# EAGLE design SRAM 4MB 2048kbx16 CPLD_2.1 (EAGLE 6.4)
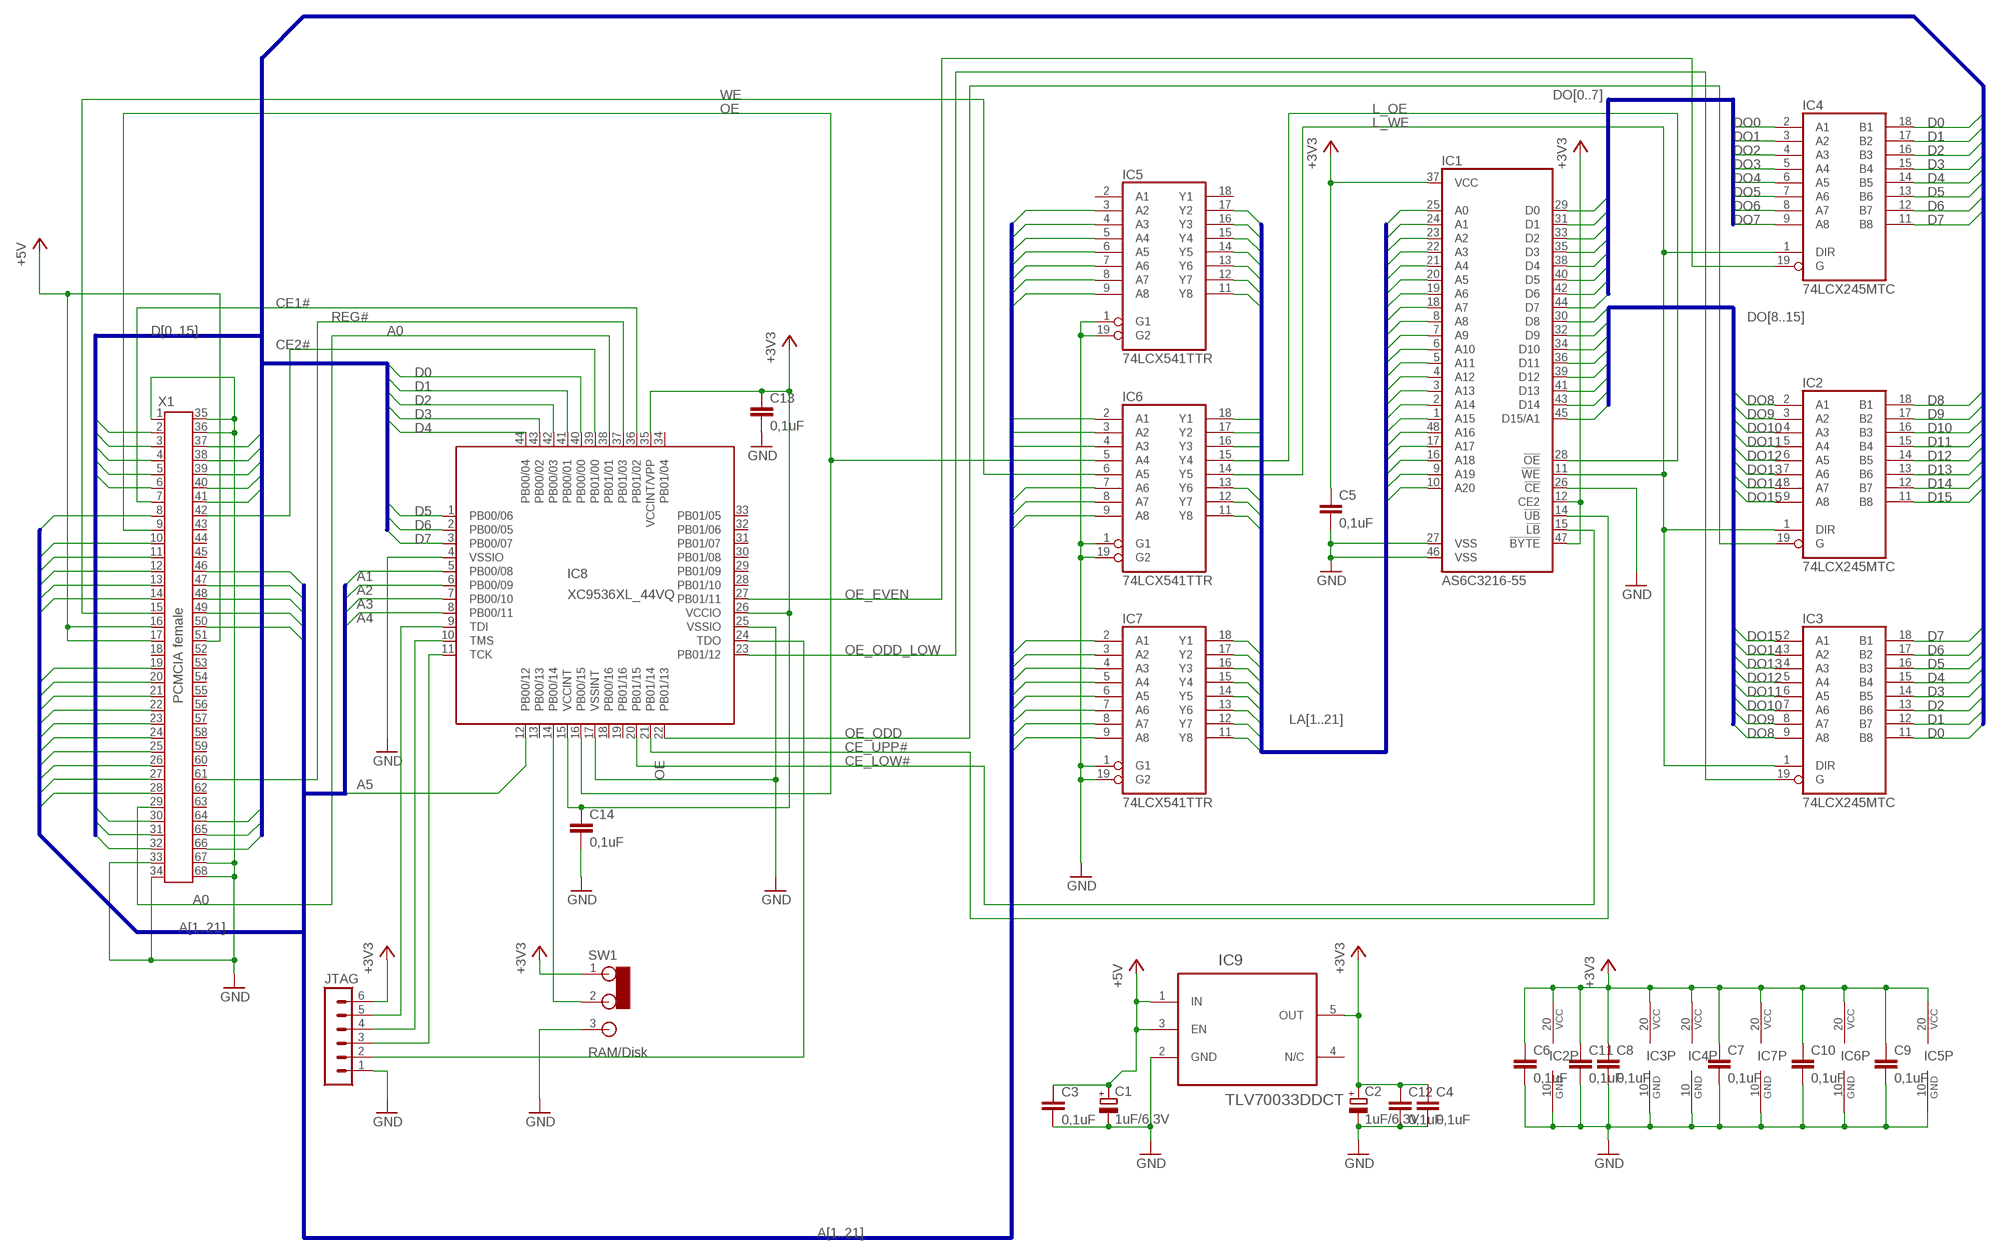
[diagram p0: schematic, sheet 1]

## Parts
C1  1uF/6,3V  CPOL-EUA/3216-18R  [A/3216-18R]
C2  1uF/6,3V  CPOL-EUA/3216-18R  [A/3216-18R]
C3  0,1uF  C-EUC0603  [C0603]
C4  0,1uF  C-EUC0603  [C0603]
C5  0,1uF  C-EUC0402K  [C0402K]
C6  0,1uF  C-EUC0402K  [C0402K]
C7  0,1uF  C-EUC0402K  [C0402K]
C8  0,1uF  C-EUC0402K  [C0402K]
C9  0,1uF  C-EUC0402K  [C0402K]
C10  0,1uF  C-EUC0402K  [C0402K]
C11  0,1uF  C-EUC0402K  [C0402K]
C12  0,1uF  C-EUC0402K  [C0402K]
C13  0,1uF  C-EUC0402K  [C0402K]
C14  0,1uF  C-EUC0402K  [C0402K]
IC1  AS6C3216-55  [TSOP-48]
IC2  74LCX245MTC  74LS245MTC  [TSSOP20]
IC3  74LCX245MTC  74LS245MTC  [TSSOP20]
IC4  74LCX245MTC  74LS245MTC  [TSSOP20]
IC5  74LCX541TTR  74541TTR  [TSSOP20]
IC6  74LCX541TTR  74541TTR  [TSSOP20]
IC7  74LCX541TTR  74541TTR  [TSSOP20]
IC8  XC9536XL_44VQ  XC9536_44VQ  [SQFP-S-10X10-44]
IC9  TLV70033DDCT  [SOT95P280X110-5N]
JTAG  MA06-1  [MA06-1]
SW1  RAM/Disk  AYZ0102AGRLC  [SWITCH2]
X1  PCMCIA female  9M681X03TB9M681Z04  [9M681X04]

## Nets
+3V3 [+3.3V]: C2.+ C4.1 C5.1 C6.1 C7.1 C8.1 C9.1 C10.1 C11.1 C12.1 C13.1 C14.1 IC1.12(CE2) IC1.37(VCC) IC1.47(!BYTE) IC2.20(VCC) IC3.20(VCC) IC4.20(VCC) IC5.20(VCC) IC6.20(VCC) IC7.20(VCC) IC8.15(VCCINT) IC8.26(VCCIO) IC8.35(VCCINT/VPP) IC9.5(OUT) JTAG.6 SW1.1
+5V [+5V]: C1.+ C3.1 IC9.1(IN) IC9.3(EN) X1.16 X1.17 X1.51
A0: IC8.38(PB01/01) X1.29
A1: IC5.3(A2) IC8.5(PB00/08) X1.28
A2: IC5.4(A3) IC8.6(PB00/09) X1.27
A3: IC5.5(A4) IC8.7(PB00/10) X1.26
A4: IC5.6(A5) IC8.8(PB00/11) X1.25
A5: IC5.7(A6) IC8.12(PB00/12) X1.24
A6: IC5.8(A7) X1.23
A7: IC5.9(A8) X1.22
A8: IC7.6(A5) X1.12
A9: IC7.7(A6) X1.11
A10: IC7.9(A8) X1.8
A11: IC7.8(A7) X1.10
A12: IC6.2(A1) X1.21
A13: IC7.4(A3) X1.13
A14: IC7.2(A1) X1.14
A15: IC6.3(A2) X1.20
A16: IC6.4(A3) X1.19
A17: IC7.5(A4) X1.46
A18: IC7.3(A2) X1.47
A19: IC6.9(A8) X1.48
A20: IC6.8(A7) X1.49
A21: IC6.7(A6) X1.50
CE1#: IC8.36(PB01/02) X1.7
CE2#: IC8.39(PB01/00) X1.42
CE_LOW#: IC1.15(!LB) IC8.20(PB01/15)
CE_UPP#: IC1.14(!UB) IC8.21(PB01/14)
D0: IC3.11(B8) IC4.18(B1) IC8.40(PB00/00) X1.30
D1: IC3.12(B7) IC4.17(B2) IC8.41(PB00/01) X1.31
D2: IC3.13(B6) IC4.16(B3) IC8.42(PB00/03) X1.32
D3: IC3.14(B5) IC4.15(B4) IC8.43(PB00/02) X1.2
D4: IC3.15(B4) IC4.14(B5) IC8.44(PB00/04) X1.3
D5: IC3.16(B3) IC4.13(B6) IC8.1(PB00/06) X1.4
D6: IC3.17(B2) IC4.12(B7) IC8.2(PB00/05) X1.5
D7: IC3.18(B1) IC4.11(B8) IC8.3(PB00/07) X1.6
D8: IC2.18(B1) X1.64
D9: IC2.17(B2) X1.65
D10: IC2.16(B3) X1.66
D11: IC2.15(B4) X1.37
D12: IC2.14(B5) X1.38
D13: IC2.13(B6) X1.39
D14: IC2.12(B7) X1.40
D15: IC2.11(B8) X1.41
DO0: IC1.29(D0) IC4.2(A1)
DO1: IC1.31(D1) IC4.3(A2)
DO2: IC1.33(D2) IC4.4(A3)
DO3: IC1.35(D3) IC4.5(A4)
DO4: IC1.38(D4) IC4.6(A5)
DO5: IC1.40(D5) IC4.7(A6)
DO6: IC1.42(D6) IC4.8(A7)
DO7: IC1.44(D7) IC4.9(A8)
DO8: IC1.30(D8) IC2.2(A1) IC3.9(A8)
DO9: IC1.32(D9) IC2.3(A2) IC3.8(A7)
DO10: IC1.34(D10) IC2.4(A3) IC3.7(A6)
DO11: IC1.36(D11) IC2.5(A4) IC3.6(A5)
DO12: IC1.39(D12) IC2.6(A5) IC3.5(A4)
DO13: IC1.41(D13) IC2.7(A6) IC3.4(A3)
DO14: IC1.43(D14) IC2.8(A7) IC3.3(A2)
DO15: IC1.45(D15/A1) IC2.9(A8) IC3.2(A1)
GND [Ground]: C1.- C2.- C3.2 C4.2 C5.2 C6.2 C7.2 C8.2 C9.2 C10.2 C11.2 C12.2 C13.2 C14.2 IC1.26(!CE) IC1.27(VSS) IC1.46(VSS) IC2.10(GND) IC3.10(GND) IC4.10(GND) IC5.1(G1) IC5.10(GND) IC5.19(G2) IC6.1(G1) IC6.10(GND) IC6.19(G2) IC7.1(G1) IC7.10(GND) IC7.19(G2) IC8.4(VSSIO) IC8.17(VSSINT) IC8.25(VSSIO) IC9.2(GND) JTAG.1 SW1.3 X1.1 X1.33 X1.34 X1.35 X1.36 X1.67 X1.68
L_OE: IC1.28(!OE) IC6.15(Y4)
L_WE: IC1.11(!WE) IC2.1(DIR) IC3.1(DIR) IC4.1(DIR) IC6.14(Y5)
LA1: IC1.25(A0) IC6.16(Y3)
LA2: IC1.24(A1) IC5.17(Y2)
LA3: IC1.23(A2) IC5.16(Y3)
LA4: IC1.22(A3) IC5.15(Y4)
LA5: IC1.21(A4) IC5.14(Y5)
LA6: IC1.20(A5) IC5.13(Y6)
LA7: IC1.19(A6) IC5.12(Y7)
LA8: IC1.18(A7) IC5.11(Y8)
LA9: IC1.8(A8) IC6.11(Y8)
LA10: IC1.7(A9) IC7.11(Y8)
LA11: IC1.6(A10) IC7.12(Y7)
LA12: IC1.5(A11) IC7.13(Y6)
LA13: IC1.4(A12) IC7.14(Y5)
LA14: IC1.3(A13) IC7.15(Y4)
LA15: IC1.2(A14) IC7.16(Y3)
LA16: IC1.1(A15) IC7.17(Y2)
LA17: IC1.48(A16) IC7.18(Y1)
LA18: IC1.17(A17) IC6.18(Y1)
LA19: IC1.16(A18) IC6.17(Y2)
LA20: IC1.9(A19) IC6.12(Y7)
LA21: IC1.10(A20) IC6.13(Y6)
N$1: IC8.24(TDO) JTAG.2
N$2: IC8.11(TCK) JTAG.3
N$3: IC8.10(TMS) JTAG.4
N$4: IC8.9(TDI) JTAG.5
N$8: IC8.14(PB00/14) SW1.2
OE: IC6.5(A4) IC8.16(PB00/15) X1.9
OE_EVEN: IC4.19(G) IC8.27(PB01/11)
OE_ODD: IC2.19(G) IC8.22(PB01/13)
OE_ODD_LOW: IC3.19(G) IC8.23(PB01/12)
REG#: IC8.37(PB01/03) X1.61
WE: IC6.6(A5) X1.15
Unconnected: IC5.2(A1) IC5.18(Y1) IC8.13(PB00/13) IC8.18(PB00/16) IC8.19(PB01/16) IC8.28(PB01/10) IC8.29(PB01/09) IC8.30(PB01/08) IC8.31(PB01/07) IC8.32(PB01/06) IC8.33(PB01/05) IC8.34(PB01/04) IC9.4(N/C) X1.18 X1.43 X1.44 X1.45 X1.52 X1.53 X1.54 X1.55 X1.56 X1.57 X1.58 X1.59 X1.60 X1.62 X1.63

## Buses
DO[8..15]
DO[0..7]
D[0..15]
A[1..21]
LA[1..21]

## Library data of the parts
C1 C2 = resistor:CPOL-EU: POLARIZED CAPACITOR, European symbol
C3-C14 = resistor:C-EU: CAPACITOR, European symbol
IC1 = Alliance_Memory_By_element14_Batch_1:AS6C3216-55: SRAM memory 32Mb (2MB x 16 lub 4MB x 8)
IC2-IC4 = 74xx-us:74*245: Octal BUS TRANSCEIVER, 3-state
IC5-IC7 = 74xx-us:74*541: Octal BUFFER and LINE DRIVER, 3-state
IC8 = xilinx-xc9:XC9536_44VQ: xc9536_pc44 XC9500 In-System Programmable CPLD Family Auto generated by make-symbol-device-package-bsdl.ulp Rev. 34 Source: xc9536_vq44.bsd; MPN: XC9536-15VQG44C; OC_FARNELL: 1193227; OC_NEWARK: 98K3377
IC9 = _V-reg33V:TLV70033DDCT: 200-mA, Low-IQ, Low-Dropout Regulator for Portable Devices; MPN: TLV70033DDCT; OC_FARNELL: 1778230; OC_NEWARK: 50R4446; PACKAGE: TSOT-23-5; SUPPLIER: Texas Instruments
JTAG = con-lstb:MA06-1: PIN HEADER; OC_FARNELL: unknown; OC_NEWARK: unknown
SW1 = amiga:AYZ0102AGRLC: SWITCH
X1 = 3M:9M681X03TB

## Net classes
0 default: width 0.102 mm
1 Ground: width 0.254 mm
2 +5V: width 0.254 mm
3 +3.3V: width 0.254 mm

## Board
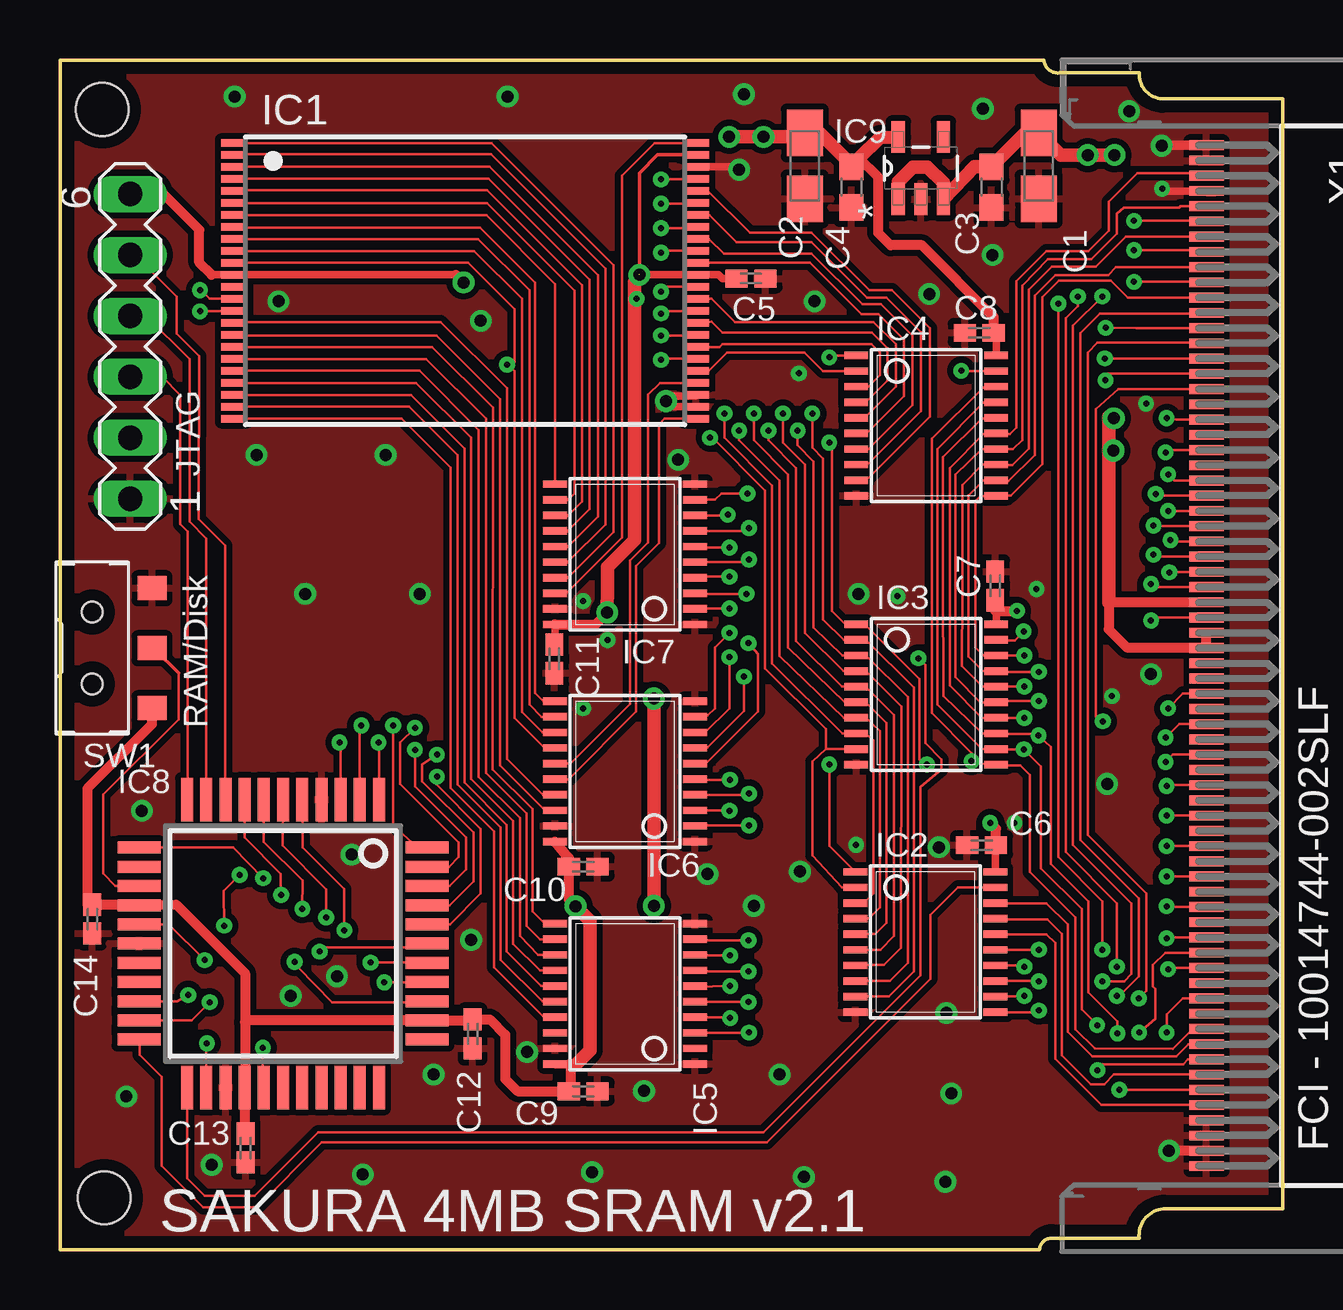
[diagram p1: board, top side]
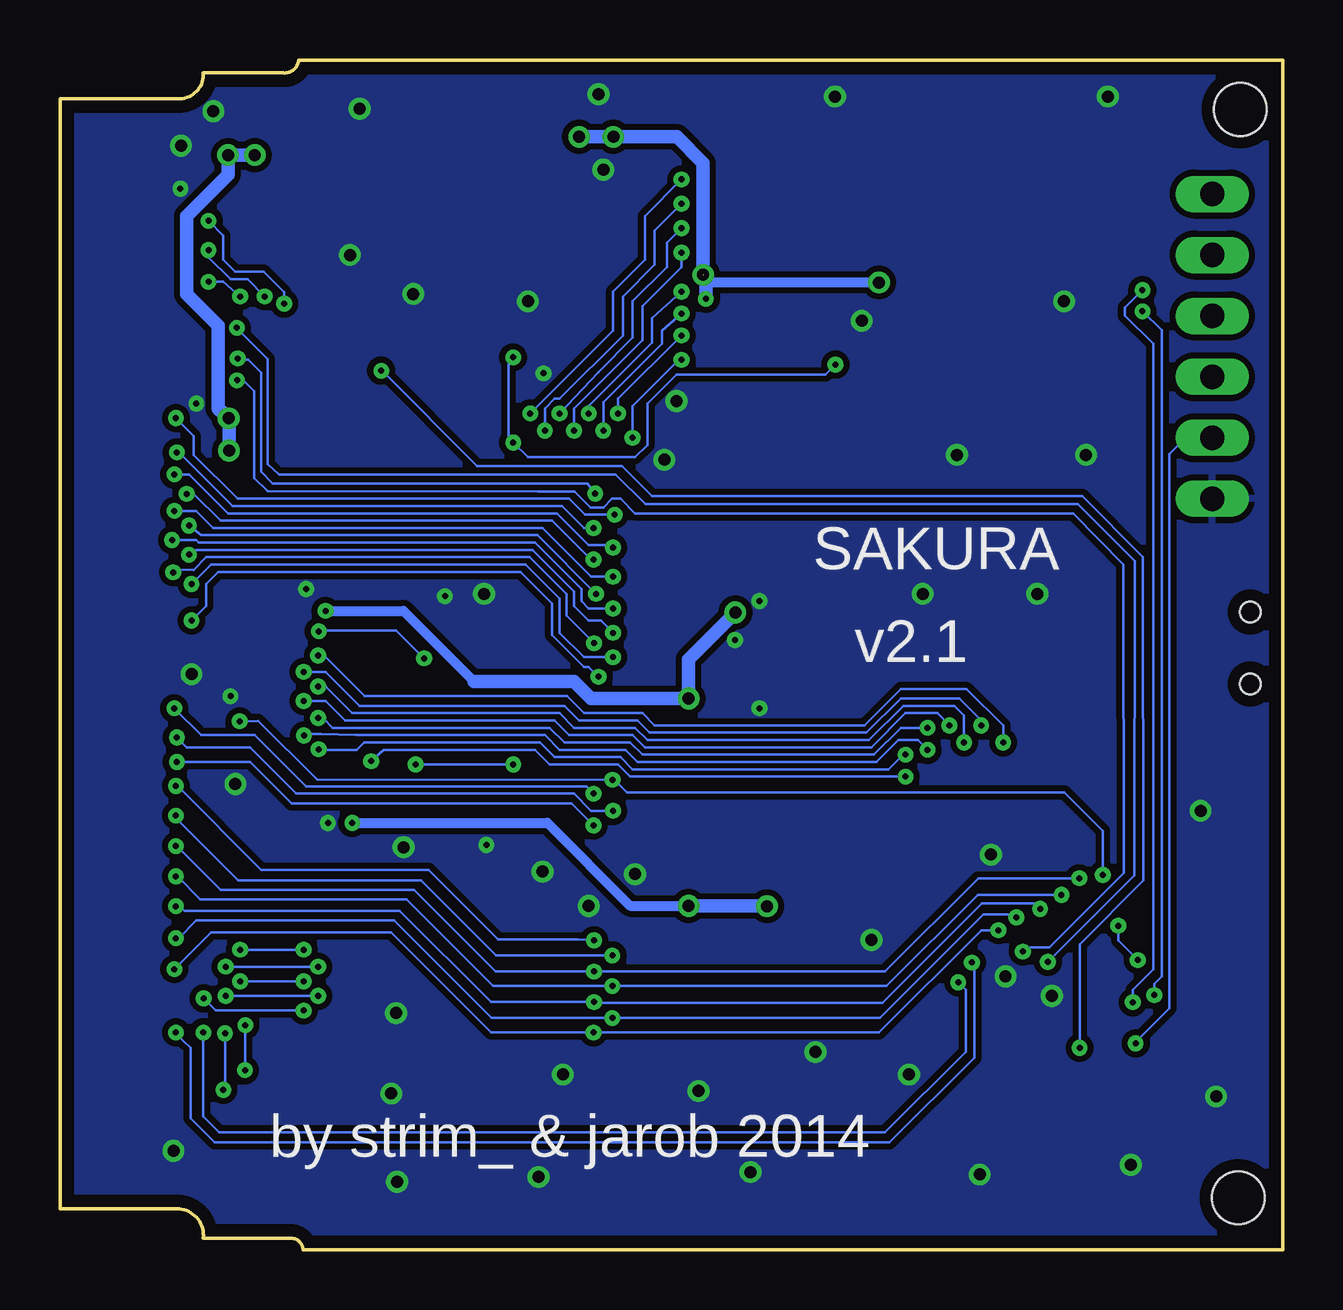
[diagram p2: board, bottom side, seen from below]

Size 50.96 x 49.6 mm. Coordinates in mm from the lower left corner, seen from the top.
Outline: 0,0 40.83,0 arc-90 41.35,0.49 44.98,0.49 arc-90 45.99,1.71 50.96,1.71 50.96,47.98 45.94,47.98 arc-90 44.98,49.06 41.65,49.06 arc-90 41.01,49.6 0,49.6 0,0
Copper layers (1*16): Top 0.035mm / dielectric 1.5mm / Bottom 0.035mm
Design rules "default *": minimum track width 0.015mm, minimum drill 0.25mm, track to track 4mil, track to pad 6mil, pad to pad 6mil, via to via 6mil, smd to smd 6mil, copper to edge 20mil, drill to drill 8mil, minimum pad ring 10mil, minimum via ring 8mil, stop-mask expansion 4mil, vias tented up to drill 20mil, thermal gap 10mil
Holes 2.2 mm at 1.85,2.17 1.76,47.54

### Footprints (pad centres in the part's own frame; a part is rotated, then mirrored left to right if it is on the bottom)
A/3216-18R = smd 1.95 x 1.5: + 1.375,0; - -1.375,0
C0603 = smd 1.1 x 1: 1 -0.85,0; 2 0.85,0
C0402K = smd 0.925 x 0.74: 1 -0.6,0; 2 0.6,0
TSOP-48 = smd 1.1 x 0.3: 1 -9.625,5.75; 2 -9.625,5.25; 3 -9.625,4.75; 4 -9.625,4.25; 5 -9.625,3.75; 6 -9.625,3.25; 7 -9.625,2.75; 8 -9.625,2.25; 9 -9.625,1.75; 10 -9.625,1.25; 11 -9.625,0.75; 12 -9.625,0.25; 13 -9.625,-0.25; 14 -9.625,-0.75; 15 -9.625,-1.25; 16 -9.625,-1.75; 17 -9.625,-2.25; 18 -9.625,-2.75; 19 -9.625,-3.25; 20 -9.625,-3.75; 21 -9.625,-4.25; 22 -9.625,-4.75; 23 -9.625,-5.25; 24 -9.625,-5.75; 25 9.625,-5.75; 26 9.625,-5.25; 27 9.625,-4.75; 28 9.625,-4.25; 29 9.625,-3.75; 30 9.625,-3.25; 31 9.625,-2.75; 32 9.625,-2.25; 33 9.625,-1.75; 34 9.625,-1.25; 35 9.625,-0.75; 36 9.625,-0.25; 37 9.625,0.25; 38 9.625,0.75; 39 9.625,1.25; 40 9.625,1.75; 41 9.625,2.25; 42 9.625,2.75; 43 9.625,3.25; 44 9.625,3.75; 45 9.625,4.25; 46 9.625,4.75; 47 9.625,5.25; 48 9.625,5.75
TSSOP20 = smd 0.305 x 0.991: 1 -2.925,-2.918; 2 -2.275,-2.918; 3 -1.625,-2.918; 4 -0.975,-2.918; 5 -0.325,-2.918; 6 0.325,-2.918; 7 0.975,-2.918; 8 1.625,-2.918; 9 2.275,-2.918; 10 2.925,-2.918; 11 2.925,2.918; 12 2.275,2.918; 13 1.625,2.918; 14 0.975,2.918; 15 0.325,2.918; 16 -0.325,2.918; 17 -0.975,2.918; 18 -1.625,2.918; 19 -2.275,2.918; 20 -2.925,2.918
SQFP-S-10X10-44 = smd 0.5 x 1.8: 1 -4,-6; 2 -3.2,-6; 3 -2.4,-6; 4 -1.6,-6; 5 -0.8,-6; 6 0,-6; 7 0.8,-6; 8 1.6,-6; 9 2.4,-6; 10 3.2,-6; 11 4,-6; 23 4,6; 24 3.2,6; 25 2.4,6; 26 1.6,6; 27 0.8,6; 28 0,6; 29 -0.8,6; 30 -1.6,6; 31 -2.4,6; 32 -3.2,6; 33 -4,6 | smd 1.8 x 0.5: 12 6,-4; 13 6,-3.2; 14 6,-2.4; 15 6,-1.6; 16 6,-0.8; 17 6,0; 18 6,0.8; 19 6,1.6; 20 6,2.4; 21 6,3.2; 22 6,4; 34 -6,4; 35 -6,3.2; 36 -6,2.4; 37 -6,1.6; 38 -6,0.8; 39 -6,0; 40 -6,-0.8; 41 -6,-1.6; 42 -6,-2.4; 43 -6,-3.2; 44 -6,-4
SOT95P280X110-5N = smd 1.321 x 0.559: 1 -1.295,0.94; 2 -1.295,0; 3 -1.295,-0.94; 4 1.295,-0.94; 5 1.295,0.94
MA06-1 = drill 1.016 long: 1 -6.35,0; 2 -3.81,0; 3 -1.27,0; 4 1.27,0; 5 3.81,0; 6 6.35,0
SWITCH2 = smd 1 x 1.2: 1 -2.5,1; 2 0,1; 3 2.5,1 | hole 0.85: -1.5,3.5; 1.5,3.5
9M681X04 = smd 0.406 x 1.422: 1 -20.955,-3.175; 2 -19.685,-3.175; 3 -18.415,-3.175; 4 -17.145,-3.175; 5 -15.875,-3.175; 6 -14.605,-3.175; 7 -13.335,-3.175; 8 -12.065,-3.175; 9 -10.795,-3.175; 10 -9.525,-3.175; 11 -8.255,-3.175; 12 -6.985,-3.175; 13 -5.715,-3.175; 14 -4.445,-3.175; 15 -3.175,-3.175; 16 -1.905,-3.175; 17 -0.635,-3.175; 18 0.635,-3.175; 19 1.905,-3.175; 20 3.175,-3.175; 21 4.445,-3.175; 22 5.715,-3.175; 23 6.985,-3.175; 24 8.255,-3.175; 25 9.525,-3.175; 26 10.795,-3.175; 27 12.065,-3.175; 28 13.335,-3.175; 29 14.605,-3.175; 30 15.875,-3.175; 31 17.145,-3.175; 32 18.415,-3.175; 33 19.685,-3.175; 34 20.955,-3.175; 35 -20.32,-3.175; 36 -19.05,-3.175; 37 -17.78,-3.175; 38 -16.51,-3.175; 39 -15.24,-3.175; 40 -13.97,-3.175; 41 -12.7,-3.175; 42 -11.43,-3.175; 43 -10.16,-3.175; 44 -8.89,-3.175; 45 -7.62,-3.175; 46 -6.35,-3.175; 47 -5.08,-3.175; 48 -3.81,-3.175; 49 -2.54,-3.175; 50 -1.27,-3.175; 51 0,-3.175; 52 1.27,-3.175; 53 2.54,-3.175; 54 3.81,-3.175; 55 5.08,-3.175; 56 6.35,-3.175; 57 7.62,-3.175; 58 8.89,-3.175; 59 10.16,-3.175; 60 11.43,-3.175; 61 12.7,-3.175; 62 13.97,-3.175; 63 15.24,-3.175; 64 16.51,-3.175; 65 17.78,-3.175; 66 19.05,-3.175; 67 20.32,-3.175; 68 21.59,-3.175

### Placement (x,y rotation side)
C1  40.79,45.19 90 top
C2  31.05,45.19 90 top
C3  38.82,44.3 270 top
C4  32.98,44.3 270 top
C5  28.8,40.49 0 top
C6  38.41,16.87 180 top
C7  38.98,27.68 90 top
C8  38.32,38.23 180 top
C9  21.81,6.61 0 top
C10  21.81,15.98 0 top
C11  20.61,24.64 270 top
C12  17.2,9 270 top
C13  7.74,4.25 270 top
C14  1.35,13.79 270 top
IC1  16.88,40.39 0 top
IC2  36.07,12.83 270 top
IC3  36.11,23.15 270 top
IC4  36.11,34.36 270 top
IC5  23.55,10.67 90 top
IC6  23.55,19.95 90 top
IC7  23.55,28.99 90 top
IC8  9.3,12.77 180 top
IC9  35.88,45.09 90 top
JTAG  2.93,37.66 90 top
SW1  4.84,25.09 90 top
X1  50.97,25.09 270 top

### Tracks (layer width: path | path; a pad name or v marks a point on that pad's centre or on a via)
+3V3  (via drill 0.25, 0.5)  (1 unrouted)
  Top 0.15: IC1.47 24.9,45.64 24.15,44.89 v24.15,40.65
  Top 0.305: 6.32,40.64 IC1.12 16.51,40.64 | 2.96,44.04 JTAG.6 | C5.1 27.62,40.49 27.46,40.65 v24.15,40.65 24.86,40.64 IC1.37 | 3.27,14.39 IC8.15 | IC8.26 | 7.78,9.57 7.71,9.5 | 17.47,9.57 C12.1 | IC5.20 | IC5.20 21.28,7.76 | 7.7,4.59 C13.1 | 1.14,14.4 C14.1 | C11.1 20.67,25.22 IC7.20 | IC5.20 20.66,7.72 21.49,7.72 | IC4.20 39.02,38.02 C8.1 | IC3.20 39.02,26.94 C7.1 | IC2.20 38.99,16.75 C6.1
  Top 0.406: 33,45.2 33,45.13 C4.1 33.17,45.05 | 31.05,46.5 C2.+ | 6.32,40.64 5.8,41.15 5.8,42.52 4.28,44.04 2.96,44.04 | 16.51,40.64 v16.82,40.33 | C14.1 3.27,14.39 | IC8.15 4.84,14.4 7.71,11.53 7.71,9.5 IC8.26 | 7.78,9.57 IC8.35 17.47,9.57 | C12.1 17.92,9.6 18.56,8.97 18.56,7.13 19.08,6.61 C9.1 21.25,6.61 21.28,6.64 21.28,7.72 21.3,7.74 21.28,7.76 | IC8.26 7.7,4.59 | SW1.1 3.83,21.9 1.14,19.23 1.14,14.4 | IC6.20 21.21,16.35 C10.1 21.21,14.61 v21.49,14.33 | 30.95,46.4 v29.32,46.39 31.46,46.39 31.46,46.35 30.8,46.4 | IC7.20 22.32,26.07 v22.81,26.57 | 23.94,40.33 v24.15,40.65 | C7.1 38.99,26.64 v39.89,26.64 | C6.1 39.01,17.56 v38.77,17.8 | v27.9,46.4 v27.9,46.39 | 33.31,45.51 34.11,44.71 34.11,42.39 34.62,41.88 35.93,41.88 38.92,38.89 C8.1
  Top 0.559: IC9.5 34.17,46.37 33.31,45.51 33,45.2 | 33.17,45.05 31.73,46.5 31.05,46.5 30.95,46.4 | v21.49,14.33 22.09,13.72 22.09,8.32 21.49,7.72 | 23.94,40.33 23.94,29.58 22.82,28.47 22.82,27.65 v22.81,26.57 | v24.75,22.98 v24.75,14.34 | 30.8,46.4 v27.9,46.4
  Bottom 0.406: v16.82,40.33 23.73,40.33 v24.15,40.65 | v39.89,26.64 36.64,26.64 33.69,23.69 | v38.77,17.8 30.65,17.8 27.19,14.34 v24.75,14.34 | 24.04,40.56 24.14,40.66
  Bottom 0.559: v29.32,46.39 25.25,46.39 24.15,45.29 v24.15,40.65 | 33.69,23.69 29.53,23.69 28.82,22.98 v24.75,22.98 24.75,24.61 v22.81,26.57 | v24.75,14.34 21.39,14.34 21.5,14.33 v21.49,14.33 | v24.04,39.64 24.04,40.56
+5V  (via drill 0.5)
  Top 0.406: 47.69,25.72 X1.17 X1.51 47.77,25.11 44.46,25.11 43.71,25.86 43.71,26.99 X1.16 | C1.+ 40.23,46.56 | 43.71,34.73 v43.92,34.66
  Top 0.559: 40.23,46.56 C3.1 38.12,45.15 IC9.3 36.82,44.48 36.16,45.14 35.55,45.14 34.94,44.53 IC9.1 | 43.71,26.99 43.71,34.73 | v43.96,45.64 41.72,45.64 C1.+
  Bottom 0.406: v43.92,34.66 43.91,34.74
  Bottom 0.559: v43.92,34.66 44.36,35.07 44.36,38.53 45.68,39.85 45.68,43.1 43.96,44.82 v43.96,45.64 v42.84,45.64 | 43.91,34.74 v43.91,33.32
A0  (via drill 0.25)
  Top 0.102: X1.29 46.8,10.48 46.13,9.81 v46.13,9.06 | v12.95,11.98 IC8.38
  Top 0.15: IC8.38
  Bottom 0.102: v46.13,9.06 46.13,9 45.52,8.43 45.52,5.49 44.51,4.48 16.38,4.48 12.85,8.01 12.85,11.88
  Bottom 0.15: 12.85,11.88 v12.95,11.98
A1  (via drill 0.25)
  Top 0.102: X1.28 46.19,11.75 v46.19,11.7 | v28.72,9.06 28.7,9.05 IC5.3 | IC8.5 10.12,18.74 10.12,16.78 11.85,15.06 v11.85,13.33
  Bottom 0.102: v46.19,11.7 44.67,13.23 37.15,13.23 32.98,9.06 v28.72,9.06 16.83,9.06 12.56,13.33 v11.85,13.33
A2  (via drill 0.25)
  Top 0.102: X1.27 46.16,13.02 v46.13,12.99 | IC8.6 9.28,16.87 11.09,15.03 v11.09,13.86 | IC5.4 27.93,9.7 v27.93,9.66
  Bottom 0.102: v46.13,12.99 46.02,12.99 45.28,13.73 37.03,13.73 32.96,9.66 v27.93,9.66 16.78,9.66 12.47,13.98 11.44,13.98 v11.09,13.86
A3  (via drill 0.25)
  Top 0.102: X1.26 46.16,14.29 v46.13,14.33 | IC8.7 8.5,17.01 10.11,15.39 v10.1,14.22 | IC5.5 28.7,10.35 v28.7,10.33
  Bottom 0.102: v46.13,14.33 45.94,14.33 45.75,14.14 36.8,14.14 32.99,10.33 v28.7,10.33 28.67,10.3 16.68,10.3 12.53,14.45 10.33,14.45 v10.1,14.22
A4  (via drill 0.25)
  Top 0.102: X1.25 v46.13,15.56 | IC8.8 7.7,17.19 9.21,15.67 9.21,14.82 v9.21,14.8 | v27.93,11 26.47,10.97 IC5.6
  Bottom 0.102: v46.13,15.56 46.06,15.56 45.12,14.62 36.51,14.62 32.9,11 28.61,11 v27.93,11 16.5,11 12.7,14.8 v9.21,14.8
A5  (via drill 0.25)
  Top 0.102: X1.24 v46.13,16.83 | IC8.12 7.21,16.77 v8.46,15.49 | v28.7,11.6 26.47,11.6 IC5.7
  Bottom 0.102: v46.13,16.83 46.1,16.83 44.26,15 36.2,15 32.8,11.6 v28.7,11.6 16.57,11.6 12.68,15.49 v8.46,15.49
A6  (via drill 0.25)
  Top 0.102: X1.23 v46.13,18.1 | v27.93,12.27 26.47,12.27 IC5.8
  Bottom 0.102: v46.13,18.1 46.13,18.01 43.52,15.4 35.92,15.4 32.78,12.27 v27.93,12.27
A7  (via drill 0.25)
  Top 0.102: X1.22 46.16,19.37 v46.13,19.34 | v28.7,12.9 26.47,12.9 IC5.9
  Bottom 0.102: v46.13,19.34 46.06,19.34 42.57,15.85 35.6,15.85 32.69,12.94 29.38,12.94 v28.7,12.9
A8  (via drill 0.25)
  Top 0.102: X1.12 46.44,32.07 v46.19,32.33 | v27.9,29.28 26.51,29.28 IC7.6
  Bottom 0.102: v46.19,32.33 45.58,32.33 43.96,30.7 30.24,30.7 28.92,29.38 28,29.38 v27.9,29.28
A9  (via drill 0.25)
  Top 0.102: X1.11 46.19,33.34 v46.09,33.24 | v28.72,30.09 28.59,29.97 IC7.7
  Bottom 0.102: v46.09,33.24 45.99,33.24 43.75,31.01 30.04,31.01 29.12,30.09 v28.72,30.09
A10  (via drill 0.25)
  Top 0.102: X1.8 44.93,37.15 v43.56,37.16 | v28.65,31.53 27.57,31.53 27.31,31.27 IC7.9
  Bottom 0.102: v43.56,37.16 43.55,37.1 43.11,37.1 42.57,36.57 42.57,32.44 42.09,31.95 28.98,31.95 v28.65,31.53
A11  (via drill 0.25)
  Top 0.102: X1.10 46.54,34.61 v46.13,34.68 | IC7.8 27.81,30.62 v27.84,30.64
  Bottom 0.102: v27.84,30.64 29.06,30.64 29.73,31.31 43.55,31.31 45.38,33.14 45.38,33.93 v46.13,34.68
A12  (via drill 0.25)
  Top 0.102: X1.21 46.39,20.64 v46.09,20.34 | v28.72,17.7 26.5,17.7 IC6.2
  Bottom 0.102: v46.09,20.34 43.04,20.34 41.31,18.61 29.63,18.61 v28.72,17.7
A13  (via drill 0.25)
  Top 0.102: X1.13 v46.19,30.8 | v27.9,28.06 26.51,28.06 IC7.4
  Bottom 0.102: v46.19,30.8 45.28,30.8 44.56,30.09 30.85,30.09 28.82,28.06 v27.9,28.06
A14  (via drill 0.25)
  Top 0.102: X1.14 46.34,29.53 v46.29,29.58 | v27.9,26.74 26.49,26.74 IC7.2
  Bottom 0.102: v46.29,29.58 45.28,29.58 45.17,29.48 31.15,29.48 29.22,27.55 29.22,27.04 28.92,26.74 v27.9,26.74
A15  (via drill 0.25)
  Top 0.102: X1.20 46.65,21.91 v46.09,21.35 | v27.9,18.31 27.89,18.32 IC6.3
  Bottom 0.102: v46.09,21.35 45.68,20.95 43.04,20.95 41.11,19.02 29.53,19.02 28.82,18.31 v27.9,18.31
A16  (via drill 0.25)
  Top 0.102: X1.19 46.8,23.18 v46.19,22.57 | v28.72,19.02 28.67,18.97 IC6.4
  Bottom 0.102: v46.19,22.57 45.07,21.46 42.84,21.46 40.7,19.32 29.02,19.32 v28.72,19.02
A17  (via drill 0.25)
  Top 0.102: X1.46 45.76,31.44 v45.68,31.51 | v28.72,28.77 28.61,28.67 IC7.5
  Bottom 0.102: v45.68,31.51 45.38,31.51 44.26,30.4 30.44,30.4 28.82,28.77 v28.72,28.77
A18  (via drill 0.25)
  Top 0.102: X1.47 45.61,30.17 v45.58,30.19 | v28.61,27.35 26.49,27.35 IC7.3
  Bottom 0.102: v45.58,30.19 45.07,29.79 31.05,29.79 v28.61,27.35
A19  (via drill 0.25)
  Top 0.102: X1.48 45.61,28.9 v45.58,28.97 | v27.9,25.72 27.29,25.11 27.29,22.57 26.99,22.27 26.52,22.27 IC6.9
  Bottom 0.102: v45.58,28.97 45.28,29.18 31.26,29.18 29.53,27.45 29.53,26.84 28.92,26.23 28.41,26.23 v27.9,25.72
A20  (via drill 0.25)
  Top 0.102: X1.49 45.5,27.63 v45.48,27.76 | v27.9,24.71 27.9,22.57 26.89,21.56 26.48,21.56 IC6.8
  Bottom 0.102: v45.48,27.76 44.67,28.57 31.56,28.57 30.14,27.15 30.14,25.72 29.12,24.71 v27.9,24.71
A21  (via drill 0.25)
  Top 0.102: X1.50 45.61,26.36 v45.48,26.23 | v28.51,23.89 28.51,22.47 26.99,20.95 26.5,20.95 IC6.7
  Bottom 0.102: v45.48,26.23 44.87,26.84 44.87,27.76 44.36,28.26 31.76,28.26 30.44,26.94 30.44,25.62 29.12,24.3 28.92,24.3 v28.51,23.89
CE1#  (via drill 0.25)
  Top 0.102: X1.7 44.87,38.42 v43.59,38.43 | v9.78,12.01 9.93,11.77 11.35,10.32 15.25,10.32
  Top 0.15: 15.25,10.32 IC8.36
  Bottom 0.102: v43.59,38.43 43.56,38.39 42.3,37.14 42.3,32.76 41.83,32.31 27.8,32.33 26.56,31.09 8.53,31.09 6.17,28.72 6.17,15.61 v9.78,12.01
CE2#  (via drill 0.25)
  Top 0.102: v10.82,12.43 10.94,12.62 15.14,12.62 15.27,12.74 | X1.42 43.65,36.52 v43.58,36.25
  Top 0.15: 15.27,12.74 IC8.39
  Bottom 0.102: v43.58,36.25 43.4,36.35 42.86,35.8 42.86,32.18 42.31,31.63 31.03,31.62 29.5,31.62 28.84,30.95 28.3,30.95 27.95,31.31 27.6,31.31 26.99,30.7 8.73,30.7 6.63,28.57 6.61,15.72 9.72,12.61 10.64,12.62 v10.82,12.43
CE_LOW#  (via drill 0.25)
  Top 0.102: IC8.20 4.89,10.37 v5.35,10.62 | v5.84,39.12 7.14,39.12
  Top 0.15: 7.14,39.12 IC1.15
  Bottom 0.102: v5.35,10.62 5.35,11.09 5.04,11.4 5.04,38.33 v5.84,39.12
CE_UPP#  (via drill 0.25)
  Top 0.102: IC8.21 5.49,9.57 v6.24,10.32 | v5.84,40.01 5.9,40.01 6.25,39.66 7.24,39.66
  Top 0.15: 7.24,39.66 IC1.14
  Bottom 0.102: v6.24,10.32 6.24,10.84 5.39,11.69 5.39,37.78 6.57,38.95 6.57,39.28 v5.84,40.01
D0  (via drill 0.25)
  Top 0.102: IC4.18 38.99,35.95 38.49,35.95 36.34,33.82 36.34,22.37 38,20.71 v38,20.37 38.15,20.32 38.65,20.23 IC3.11 39.05,20.2 40.04,20.2 40.43,19.81 40.43,15.75 42.32,13.86 42.32,9.2 43.14,8.4 46.39,8.39 47.22,9.21 X1.30 | IC8.40 16.26,13.57 17.54,14.85 17.54,17.55 15.67,19.42 15.67,19.79 v15.71,19.73
  Bottom 0.102: v15.71,19.73 27.19,19.73 27.7,20.24 30.54,20.24 31.15,20.85 37.47,20.85 v38,20.37
D1  (via drill 0.25)
  Top 0.102: IC4.17 39,35.31 38.49,35.31 36.57,33.38 36.57,25.76 36.58,25.08 36.58,22.73 38.43,20.88 IC3.12 39.04,20.87 v40.18,20.87 40.88,20.16 40.88,15.9 42.59,14.2 42.59,10.02 43.13,9.48 v43.23,9.37 | X1.31 47,7.94 46.82,7.74 43.45,7.74 43.26,7.56 v43.25,7.49 | IC8.41 16.24,14.37 17.23,15.36 17.23,17.39 15.1,19.53 15.1,20.24 v15.71,20.64
  Bottom 0.102: v43.25,7.49 43.25,9.34 v43.23,9.37 | v15.71,20.64 15.81,20.64 16.42,20.03 27.09,20.03 27.6,20.54 30.34,20.54 30.95,21.15 38.28,21.15 38.59,20.85 40.2,20.85 40.2,20.87 v40.18,20.87
D2  (via drill 0.25)
  Top 0.102: IC4.16 38.99,34.65 38.42,34.65 36.81,33.04 36.81,25.83 36.82,25.24 36.82,23.09 38.45,21.53 IC3.13 39.05,21.5 40.55,21.5 | X1.32 v44.15,6.67 | v44.08,9.03 44.08,9.52 42.86,10.74 42.86,14.52 41.3,16.08 41.3,20.95 v40.79,21.45 | v40.79,21.45 40.55,21.5 | 40.55,21.5 40.7,21.5 40.73,21.49 v40.79,21.45 | IC8.42 16.23,15.17 16.93,15.87 16.93,17.19 14.8,19.32 v14.8,20.85
  Bottom 0.102: v44.15,6.67 44.08,6.74 v44.08,9.03 | v14.8,20.85 15.2,21.25 16.02,21.25 16.93,20.34 26.89,20.34 27.39,20.85 30.14,20.85 30.75,21.46 38.61,21.46 40.09,21.5 40.53,21.5 v40.79,21.45
D3  (via drill 0.25)
  Top 0.102: IC8.43 16.22,15.97 16.62,16.38 16.62,16.99 14.19,19.42 14.19,21.15 v14.8,21.76 | v40.2,22.17 39.03,22.17 IC3.14 38.43,22.18 37.08,23.54 37.08,32.59 38.49,34.01 39,34.01 IC4.15 39.05,34.01 39.59,34.01 39.87,34.28 39.87,40.37 41.12,41.63 42.86,41.63 43.72,42.49 43.72,43.69 44.91,44.88 47.69,44.88 X1.2
  Bottom 0.102: v14.8,21.76 15.91,21.76 17.03,20.64 26.68,20.64 27.19,21.15 29.93,21.15 30.54,21.76 39.59,21.76 39.99,22.17 v40.2,22.17
D4  (via drill 0.25)
  Top 0.102: X1.3 46.7,43.5 46.65,43.45 44.34,43.45 44.06,43.2 44.06,42.35 42.99,41.29 41.18,41.29 40.11,40.19 40.11,33.76 39.73,33.38 39.03,33.38 IC4.14 38.42,33.38 37.33,32.31 37.33,25.93 37.33,25.56 37.33,23.87 38.36,22.83 IC3.15 39.08,22.88 v40.81,22.88 | IC8.44 14.91,16.77 13.88,17.7 v13.88,21.86
  Bottom 0.102: v40.81,22.88 39.89,22.88 39.08,22.07 30.34,22.07 29.73,21.46 27.09,21.46 26.58,20.95 17.13,20.95 15.71,22.37 14.39,22.37 v13.88,21.86
D5  (via drill 0.25)
  Top 0.102: X1.4 44.44,42.23 43.19,40.98 41.34,40.98 40.39,40.02 40.39,33.4 39.69,32.71 39.05,32.71 IC4.13 38.46,32.74 37.61,31.88 37.61,26.03 37.6,25.7 37.6,24.35 38.44,23.48 IC3.16 39.04,23.49 v40.2,23.49 | IC8.1 13.3,21.13 v13.27,21.15
  Bottom 0.102: v13.27,21.15 13.27,22.27 13.68,22.68 15.81,22.68 17.23,21.25 26.48,21.25 26.99,21.76 29.53,21.76 30.14,22.37 38.77,22.37 39.89,23.49 v40.2,23.49
D6  (via drill 0.25)
  Top 0.102: X1.5 44.01,40.96 43.69,40.64 41.49,40.64 40.63,39.78 40.63,33.14 39.54,32.04 39.07,32.04 IC4.12 38.49,32.07 37.86,31.44 37.86,26.14 37.86,25.83 37.86,24.73 38.47,24.13 IC3.17 39.05,24.1 v40.81,24.1 | IC8.2 12.5,21.8 v12.56,21.86
  Bottom 0.102: 12.56,21.76 v12.56,21.86 12.56,22.07 13.48,22.98 15.91,22.98 17.34,21.56 26.38,21.56 26.89,22.07 29.32,22.07 29.93,22.68 38.47,22.68 39.89,24.1 v40.81,24.1
D7  (via drill 0.25)
  Top 0.102: X1.6 44.5,39.7 43.8,40.4 41.64,40.4 40.95,39.71 40.95,32.75 39.63,31.44 IC4.11 39,31.41 38.37,31.41 38.16,31.21 38.16,25.11 38.5,24.78 IC3.18 | IC8.3 11.7,21.1 v11.65,21.15 | IC3.18 v40.2,24.78 | IC3.18 40.27,24.78
  Bottom 0.102: v11.65,21.15 11.65,21.86 13.17,23.39 15.91,23.39 17.44,21.86 26.18,21.86 26.68,22.37 29.12,22.37 29.83,23.08 38.27,23.08 39.89,24.71 40.13,24.71 v40.2,24.78
D8
  Top 0.102: X1.64 47.04,8.58 46.54,8.07 43.03,8.07 42.01,9.09 42.01,13.56 41.12,14.45 IC2.18
D9
  Top 0.102: X1.65 43.93,7.31 43.52,6.9 42.97,6.9 41.76,8.11 41.76,13.18 41.15,13.79 39.02,13.79 IC2.17
D10
  Top 0.102: X1.66 43.42,6.04 41.48,7.97 41.48,12.79 41.12,13.15 IC2.16
D11  (via drill 0.25)
  Top 0.102: IC2.15 v40.8,12.51 v40.81,12.52 | v43.45,12.52 43.45,14.53 41.62,16.38 v41.62,39.44 | v44.77,42.89 47.77,42.89 X1.37
  Bottom 0.102: v40.81,12.52 v43.45,12.52 | v41.62,39.44 41.62,39.92 42.48,40.77 43.66,40.77 44.16,41.27 44.16,42.28 v44.77,42.89
D12  (via drill 0.25)
  Top 0.102: IC2.14 40.14,11.86 v40.2,11.8 | v44.06,11.8 44.06,14.45 41.92,16.58 41.92,38.83 42.43,39.34 v42.43,39.74 | v44.77,41.67 47.71,41.67 X1.38
  Bottom 0.102: v40.2,11.8 v44.06,11.8 | v42.43,39.74 43.14,40.46 43.85,40.46 44.77,41.37 v44.77,41.67
D13  (via drill 0.25)
  Top 0.102: IC2.13 40.79,11.21 v40.81,11.19 | v43.45,11.19 44.36,11.19 44.67,11.5 44.67,14.45 42.23,16.88 42.23,38.53 v43.45,39.74 | v44.77,40.35 47.77,40.35 X1.39
  Bottom 0.102: v40.81,11.19 v43.45,11.19 | v43.45,39.74 44.16,40.35 v44.77,40.35
D14  (via drill 0.25)
  Top 0.102: IC2.12 40.17,10.56 v40.2,10.59 | v44.06,10.59 44.16,10.59 44.97,11.4 44.97,14.65 42.53,17.09 42.53,38.22 43.35,39.03 47.77,39.03 X1.40
  Bottom 0.102: v40.2,10.59 v44.06,10.59
D15  (via drill 0.25)
  Top 0.102: IC2.11 40.74,9.91 v40.81,9.98 | v44.97,10.48 45.28,10.79 45.28,14.85 42.84,17.29 42.84,37.41 43.24,37.81 47.77,37.81 X1.41
  Bottom 0.102: v40.81,9.98 44.46,9.98 v44.97,10.48
DO0
  Top 0.102: IC4.2 31.8,36.63 31.03,37.41 27.8,37.41 27.03,36.63 IC1.29
  Top 0.15: IC1.29
DO1
  Top 0.102: IC4.3 33.7,35.98 34.17,36.46 34.17,37.41 33.82,37.76 27.62,37.76 27.49,37.63 26.52,37.63
  Top 0.15: 26.52,37.63 IC1.31
DO2
  Top 0.102: IC4.4 33.59,35.33 34.49,36.23 34.49,37.6 33.85,38.23 27.62,38.23 27.17,38.68 26.55,38.68
  Top 0.15: 26.55,38.68 IC1.33
DO3
  Top 0.102: IC4.5 33.54,34.68 34.84,35.98 34.84,37.76 33.92,38.68 28.14,38.68 27.16,39.66 26.53,39.66
  Top 0.15: 26.53,39.66 IC1.35
DO4
  Top 0.102: IC4.6 33.62,34.03 35.19,35.6 35.19,37.95 34.12,39.01 33.4,39.01 31.26,41.15 26.52,41.15
  Top 0.15: 26.52,41.15 IC1.38
DO5
  Top 0.102: IC4.7 33.7,33.38 35.54,35.22 35.54,38.11 34.22,39.42 33.44,39.42 31.33,41.53 27.67,41.53 27.06,42.14 IC1.40
  Top 0.15: IC1.40
DO6
  Top 0.102: IC4.8 33.66,32.73 35.88,34.96 35.88,38.26 34.45,39.7 33.64,39.7 31.33,42 28.19,42 27.07,43.12 26.53,43.12
  Top 0.15: 26.53,43.12 IC1.42
DO7
  Top 0.102: IC4.9 33.61,32.08 36.27,34.74 36.27,38.42 34.68,40.01 33.73,40.01 31.33,42.41 28.75,42.4 27.02,44.14 IC1.44
  Top 0.15: IC1.44
DO8  (via drill 0.25)
  Top 0.102: IC3.9 31.92,20.88 | 31.92,20.88 31.36,20.37 31.36,16.45 32.59,15.11 IC2.2 | 31.92,20.88 31.92,21.71 29.39,24.23 29.39,31.65 27.19,33.85 v27.09,33.85 | v25.06,37.1 25.1,37.14 IC1.30
  Top 0.15: 26.53,37.12 IC1.30
  Bottom 0.102: v25.06,37.1 25.16,37.1 27.09,35.17 v27.09,33.85
DO9  (via drill 0.25)
  Top 0.102: IC2.3 33.51,14.47 33.9,14.86 33.9,21.23 33.62,21.51 33.24,21.51 IC3.8 32.61,21.53 29.68,24.45 29.68,31.86 27.7,33.85 v27.7,34.87 | v25.06,38.12 26.49,38.12 IC1.32
  Bottom 0.102: v27.7,34.87 27.7,35.48 v25.06,38.12
DO10  (via drill 0.25)
  Top 0.102: IC2.4 33.71,13.81 34.18,14.27 34.18,21.63 33.49,22.27 33.24,22.17 IC3.7 32.67,22.18 29.99,24.75 29.99,32.07 28.31,33.75 v28.31,34.16 | v25.06,39.03 25.06,39.13 IC1.34
  Bottom 0.102: v28.31,34.16 28.31,35.33 25.87,37.77 25.87,38.32 v25.06,39.03
DO11  (via drill 0.25)
  Top 0.102: IC2.5 33.16,13.18 33.99,13.18 34.44,13.63 34.46,21.96 33.59,22.83 33.34,22.83 IC3.6 32.73,22.83 30.34,25.11 30.34,32.33 28.92,33.75 v28.92,34.87 | v25.06,39.95 25.15,40.14 IC1.36
  Bottom 0.102: v28.92,34.87 28.92,35.17 26.28,37.81 26.28,38.83 v25.06,39.95
DO12  (via drill 0.25)
  Top 0.102: IC2.6 34.2,12.52 34.76,13.08 34.76,22.29 33.59,23.46 33.24,23.46 IC3.5 32.59,23.48 30.68,25.38 30.68,32.6 29.53,33.75 v29.53,34.16 | v25.06,41.57 25.13,41.64 IC1.39
  Bottom 0.102: v29.53,34.16 29.53,35.07 26.68,37.92 26.68,39.34 25.06,40.96 v25.06,41.57
DO13  (via drill 0.25)
  Top 0.102: IC2.7 33.16,11.88 34.35,11.88 35.05,12.58 35.07,22.65 33.59,24.12 33.24,24.12 IC3.4 32.65,24.13 31.05,25.72 31.05,32.73 30.14,33.66 v30.14,34.87 | v25.06,42.59 26.46,42.59 IC1.41
  Bottom 0.102: v30.14,34.87 28.51,36.59 27.09,38.02 27.09,39.54 25.67,40.96 25.67,41.98 v25.06,42.59
DO14  (via drill 0.25)
  Top 0.102: IC2.8 34.59,11.22 35.34,11.97 35.34,23.04 33.62,24.76 33.24,24.76 IC3.3 32.61,24.78 31.41,25.95 31.41,32.86 30.75,33.55 v30.75,34.16 | v25.06,43.61 26.47,43.61 IC1.43
  Bottom 0.102: v30.75,34.16 30.75,35.07 30.34,35.48 30.14,35.48 27.5,38.12 27.5,39.74 26.18,41.07 26.18,42.49 v25.06,43.61
DO15  (via drill 0.25)
  Top 0.102: IC2.9 34.55,10.56 35.59,11.6 35.59,23.44 33.59,25.42 33.24,25.42 IC3.2 32.67,25.43 31.81,26.29 31.81,32.99 31.36,33.45 v31.36,34.87 | v25.06,44.62 26.49,44.62 IC1.45
  Bottom 0.102: v31.36,34.87 27.9,38.32 27.9,39.95 26.58,41.27 26.58,43.1 v25.06,44.62
GND  (via drill 0.25, 0.5)
  Top 0.305: X1.36 45.95,44.14 v45.94,44.23 | IC1.26 25.6,35.14 v25.26,35.38 25.57,35.58 26.48,35.58 | IC1.46 27.89,45.14 27.9,45.13
  Top 0.406: X1.1 47.87,46.04 v45.92,46.02 | X1.36 48.17,44.14 | X1.34 47.84,4.13 v46.23,4.13
  other vias: 44.56,47.47 36.91,2.84 38.47,47.57 38.87,41.47 30.8,36.54 45.48,24 43.85,23.08 36.23,39.85 31.46,39.54 33.29,27.35 25.77,32.94 28.92,14.34 30.85,15.77 36.64,16.78 43.65,19.42 36.94,9.87 37.15,6.52 24.35,6.62 19.47,8.25 17.13,12.92 12.15,16.48 17.54,38.73 15,27.35 8.19,33.14 3.42,18.31 21.81,27.04 22.82,25.42 21.81,22.57 33.19,16.88 28.31,45.03 9.61,10.59 11.54,11.4 9.11,39.54 7.28,48.08 18.66,48.08 28.51,48.18 40.7,27.55 39.79,17.8 31.01,3.04 30,7.31 22.17,3.24 12.62,3.14 15.57,7.31 6.32,3.55 2.77,6.39 10.22,27.35 13.58,33.14 45.28,35.27 26.99,15.67 34.91,27.25
  pour Top (isolate 0.254): -0.41,49.94 51.52,49.85 51.52,-0.41 -0.51,-0.25
  pour Bottom (isolate 0.254): -0.41,49.85 51.52,49.96 51.52,-0.32 -0.41,-0.43
L_OE
  Top 0.102: IC6.15 21.27,20.27 23.77,22.76 23.77,28.73 24.52,29.48 24.52,35.65 25.01,36.14 IC1.28
  Top 0.15: IC1.28
L_WE  (via drill 0.25)
  Top 0.102: IC6.14 20.2,20.92 18.94,22.17 18.95,36.63 18.68,36.9 v18.64,36.9 18.94,37 18.94,39.22 17.01,41.15 7.27,41.15 | IC4.1 32.15,37.28 v32.07,37.2 | v32.07,33.65 32.17,33.55 32.17,26.64 32.73,26.08 IC3.1 33.24,26.03 33.59,26.03 35.83,23.79 35.83,20.44 v36.13,20.24 | IC2.1 32.07,16.85 v32.07,20.24
  Top 0.15: 7.27,41.15 IC1.11
  Bottom 0.102: v32.07,37.2 32.27,36.9 32.27,33.95 v32.07,33.65 31.46,33.04 26.99,33.04 26.48,33.55 26.48,35.27 25.26,36.49 19.04,36.49 v18.64,36.9 | v32.07,20.24 v36.13,20.24
LA1
  Top 0.102: IC6.16 21.2,19.62 24.02,22.44 24.02,28.5 24.97,29.46 24.97,34.41 25.2,34.65 IC1.25
  Top 0.15: IC1.25
LA2
  Top 0.102: IC5.17 20.18,9.7 18.1,11.78 18.1,17.44 16.28,19.25 16.28,32.61 14.25,34.65 IC1.24
  Top 0.15: IC1.24
LA3
  Top 0.102: IC1.23 14.55,35.14 16.57,33.12 16.57,19.4 18.36,17.61 18.36,12.1 20.12,10.36 IC5.16
  Top 0.15: IC5.16
LA4
  Top 0.102: IC5.15 20.05,11 18.62,12.43 18.62,17.72 16.87,19.48 16.87,33.39 14.63,35.63 7.27,35.63
  Top 0.15: 7.27,35.63 IC1.22
LA5
  Top 0.102: IC5.14 20.01,11.65 18.89,12.76 18.89,17.89 17.14,19.64 17.14,33.85 14.85,36.14 IC1.21
  Top 0.15: IC1.21
LA6
  Top 0.102: IC5.13 19.93,12.3 19.17,13.08 19.17,18.01 17.45,19.71 17.45,34.18 14.98,36.65 IC1.20
  Top 0.15: IC1.20
LA7
  Top 0.102: IC5.12 20.01,12.95 19.44,13.51 19.44,18.19 17.76,19.88 17.76,34.65 15.27,37.12 7.28,37.12
  Top 0.15: 7.28,37.12 IC1.19
LA8
  Top 0.102: 20.21,13.6 19.7,14.12 19.7,18.39 18.04,20.03 18.05,35.11 15.52,37.63 7.27,37.63
  Top 0.15: IC5.11 20.21,13.6 | 7.27,37.63 IC1.18
LA9
  Top 0.102: IC6.11 20.15,22.87 19.81,23.22 19.81,40.33 17.52,42.61 7.29,42.61
  Top 0.15: 7.29,42.61 IC1.8
LA10
  Top 0.102: IC7.11 20.63,40.26 17.77,43.12 7.28,43.12
  Top 0.15: 7.28,43.12 IC1.7
LA11
  Top 0.102: 21.19,31.27 21.45,31.53 21.45,39.99 17.81,43.63 IC1.6
  Top 0.15: IC7.12 21.19,31.27 | IC1.6
LA12
  Top 0.102: 21.18,30.62 21.76,31.2 21.76,40.21 17.81,44.17 7.29,44.17
  Top 0.15: IC7.13 21.18,30.62 | 7.29,44.17 IC1.5
LA13
  Top 0.102: 21.16,29.97 22.07,30.88 22.07,40.44 17.87,44.65 IC1.4
  Top 0.15: IC7.14 21.16,29.97 | IC1.4
LA14
  Top 0.102: 21.18,29.32 22.42,30.56 22.42,40.63 17.9,45.15 7.27,45.15
  Top 0.15: IC7.15 21.18,29.32 | 7.27,45.15 IC1.3
LA15
  Top 0.102: 21.16,28.67 22.73,30.24 22.73,40.89 17.96,45.66 7.28,45.66
  Top 0.15: IC7.16 21.16,28.67 | 7.28,45.66 IC1.2
LA16
  Top 0.102: 21.18,28.02 23.08,29.92 23.08,41.05 18,46.14 IC1.1
  Top 0.15: IC7.17 21.18,28.02 | IC1.1
LA17
  Top 0.102: 21.1,27.37 23.43,29.7 23.43,44.78 24.79,46.14 IC1.48
  Top 0.15: IC7.18 21.1,27.37 | IC1.48
LA18
  Top 0.102: IC6.18 20.19,18.35 18.34,20.2 18.34,35.46 15.7,38.11 7.3,38.11
  Top 0.15: 7.3,38.11 IC1.17
LA19
  Top 0.102: IC6.17 20.13,18.97 18.63,20.47 18.63,35.92 15.87,38.68 7.3,38.68
  Top 0.15: 7.3,38.68 IC1.16
LA20
  Top 0.102: IC6.12 20.07,22.22 19.56,22.74 19.56,40 17.42,42.14 IC1.9
  Top 0.15: IC1.9
LA21
  Top 0.102: IC6.13 20.12,21.57 19.26,22.43 19.25,39.64 17.27,41.63 IC1.10
  Top 0.15: IC1.10
N$1  (via drill 0.25)
  Top 0.102: IC8.24 6.1,8.59
  Top 0.15: 6.1,8.59 v6.12,8.61
  Bottom 0.102: 6.12,8.67 4.72,10.08 4.72,33.18 4.05,33.85 JTAG.2 2.91,33.85
  Bottom 0.15: v6.12,8.61 6.12,8.67
N$2
  Top 0.102: JTAG.3 4.26,36.39 5.02,35.64 5.02,30.25 5.33,29.94 5.33,18.8
  Top 0.15: 5.33,18.8 IC8.11
N$3
  Top 0.102: JTAG.4 3.6,38.93 5.4,37.13 5.4,30.35 6.09,29.66 6.09,18.78
  Top 0.15: 6.09,18.78 IC8.10
N$4
  Top 0.102: JTAG.5 3.14,41.47 4.86,39.74 4.86,38.19 5.79,37.26 5.78,30.46 6.88,29.36 6.88,18.78
  Top 0.15: 6.88,18.78 IC8.9
N$8
  Top 0.102: 4.95,24.05 4.95,22.1 1.8,18.98 1.8,15.69 2.31,15.18 3.28,15.18
  Top 0.15: SW1.2 3.94,25.03 4.95,24.05 | 3.28,15.18 IC8.14
OE  (via drill 0.25)
  Top 0.102: X1.9 44.11,35.88 43.17,35.05 43.17,22.22 v43.47,22.03 | v27.93,19.6 26.49,19.6 | IC8.16 4.54,13.57 v6.03,12.08 | v6.85,13.51 6.83,14.97 v7.49,15.63
  Top 0.15: 26.49,19.6 IC6.5
  Bottom 0.102: v43.47,22.03 42.69,22.05 40.25,19.6 v27.93,19.6 28,19.63 27.88,19.63 27.32,19.06 15.49,19.06 14.59,19.08 9.09,19.07 7.49,17.46 v7.49,15.63 | v6.03,12.08 6.85,12.9 v6.85,13.51
OE_EVEN  (via drill 0.25)
  Top 0.102: IC4.19 v37.58,36.63 v37.57,36.65 | v8.46,8.42 8.47,6.8
  Top 0.15: 8.47,6.8 IC8.27
  Bottom 0.102: v37.57,36.65 37.54,36.65 33.57,32.67 27.53,32.67 26.28,31.41 8.34,31.41 5.82,28.89 5.8,15.39 8.46,12.74 v8.46,8.42
OE_ODD
  Top 0.102: IC2.19 37.43,15.11 36.28,13.96 36.28,11.3 29.46,4.48 10.92,4.48 8.22,1.78 5.96,1.78 4.25,3.5 4.25,7.21 3.33,8.13 3.33,8.74
  Top 0.15: 3.33,8.74 IC8.22
OE_ODD_LOW  (via drill 0.25)
  Top 0.102: IC8.23 5.3,2.99 6.03,2.26 8.12,2.26 10.76,4.9 29.33,4.9 35.87,11.45 35.87,19.3 36.74,20.03 36.74,20.44 36.07,21.13 36.07,24.38 v35.78,24.66 | v40.17,25.79 v40.18,25.79 39.8,25.41 39.05,25.41 IC3.19
  Bottom 0.102: v35.78,24.66 36.94,25.83 40.11,25.83 v40.17,25.79
REG#  (via drill 0.25)
  Top 0.102: X1.61 46.08,12.39 45.56,11.89 45.56,10.99 45.66,10.89 45.66,9.64 v44.98,9.06 | v13.52,11.15 15.28,11.15
  Top 0.15: 15.28,11.15 IC8.37
  Bottom 0.102: v44.98,9.06 44.98,5.56 44.32,4.9 16.57,4.9 13.2,8.26 13.2,10.83 v13.52,11.15
WE  (via drill 0.25)
  Top 0.102: v28.7,25.29 29.1,24.84 29.1,22.44 26.89,20.23 26.51,20.23 | X1.15 46.16,28.26 v46.24,28.24
  Top 0.15: 26.51,20.23 IC6.6
  Bottom 0.102: v46.24,28.24 46.09,28.37 45.4,28.35 44.87,28.87 31.38,28.87 29.84,27.35 29.84,26.43 v28.7,25.29

### Text on the board
tNames: SAKURA 4MB SRAM v2.1
bNames: SAKURA | v2.1 | by strim_ & jarob 2014